# EAGLE design NeoDigito Mini X (EAGLE 9.1.3)
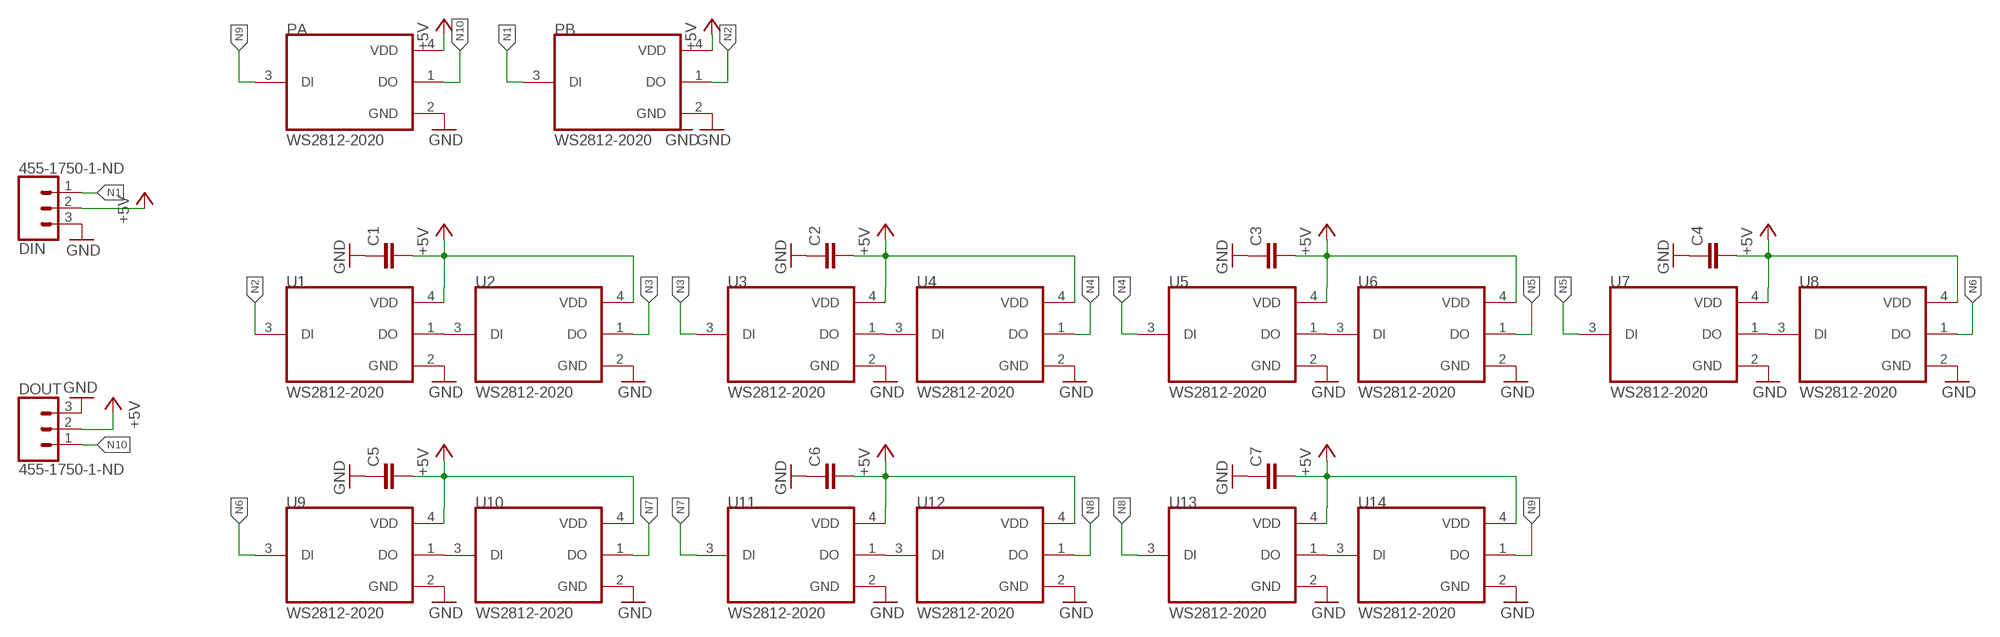
[diagram p0: schematic, sheet 1]

## Parts
C1  C-EUC0805  [C0805]
C2  C-EUC0805  [C0805]
C3  C-EUC0805  [C0805]
C4  C-EUC0805  [C0805]
C5  C-EUC0805  [C0805]
C6  C-EUC0805  [C0805]
C7  C-EUC0805  [C0805]
DIN  455-1750-1-ND  CONN_03  [1X03]
DOUT  455-1750-1-ND  CONN_03  [1X03]
PA  WS2812-2020  [LED_WS2812-2020]
PB  WS2812-2020  [LED_WS2812-2020]
U1  WS2812-2020  [LED_WS2812-2020]
U2  WS2812-2020  [LED_WS2812-2020]
U3  WS2812-2020  [LED_WS2812-2020]
U4  WS2812-2020  [LED_WS2812-2020]
U5  WS2812-2020  [LED_WS2812-2020]
U6  WS2812-2020  [LED_WS2812-2020]
U7  WS2812-2020  [LED_WS2812-2020]
U8  WS2812-2020  [LED_WS2812-2020]
U9  WS2812-2020  [LED_WS2812-2020]
U10  WS2812-2020  [LED_WS2812-2020]
U11  WS2812-2020  [LED_WS2812-2020]
U12  WS2812-2020  [LED_WS2812-2020]
U13  WS2812-2020  [LED_WS2812-2020]
U14  WS2812-2020  [LED_WS2812-2020]

## Nets
+5V: C1.2 C2.2 C3.2 C4.2 C5.2 C6.2 C7.2 DIN.2 DOUT.2 PA.4(VDD) PB.4(VDD) U1.4(VDD) U2.4(VDD) U3.4(VDD) U4.4(VDD) U5.4(VDD) U6.4(VDD) U7.4(VDD) U8.4(VDD) U9.4(VDD) U10.4(VDD) U11.4(VDD) U12.4(VDD) U13.4(VDD) U14.4(VDD)
GND: C1.1 C2.1 C3.1 C4.1 C5.1 C6.1 C7.1 DIN.3 DOUT.3 PA.2(GND) PB.2(GND) U1.2(GND) U2.2(GND) U3.2(GND) U4.2(GND) U5.2(GND) U6.2(GND) U7.2(GND) U8.2(GND) U9.2(GND) U10.2(GND) U11.2(GND) U12.2(GND) U13.2(GND) U14.2(GND)
N1: DIN.1 PB.3(DI)
N2: PB.1(DO) U1.3(DI)
N3: U2.1(DO) U3.3(DI)
N4: U4.1(DO) U5.3(DI)
N5: U6.1(DO) U7.3(DI)
N6: U8.1(DO) U9.3(DI)
N7: U10.1(DO) U11.3(DI)
N8: U12.1(DO) U13.3(DI)
N9: PA.3(DI) U14.1(DO)
N10: DOUT.1 PA.1(DO)
N$1: U1.1(DO) U2.3(DI)
N$2: U3.1(DO) U4.3(DI)
N$3: U5.1(DO) U6.3(DI)
N$4: U7.1(DO) U8.3(DI)
N$5: U9.1(DO) U10.3(DI)
N$6: U11.1(DO) U12.3(DI)
N$7: U13.1(DO) U14.3(DI)

## Library data of the parts
C1-C7 = NeoDigito Mini:C-EU: CAPACITOR, European symbol; SPICEPREFIX: C
DIN DOUT = NeoDigito Mini:CONN_03: Multi connection point. Often used as Generic Header-pin footprint for 0.1 inch spaced/style header connections On any of the 0.1 inch spaced packages, you can populate with these: Break Away Headers - Straight <https://www.sparkfun.com/products/116> (PRT-00116) Break Away Male Headers - Right Angle <https://www.sparkfun.com/products/553> (PRT-00553) Female Headers <https://www.sparkfun.com/products/115> (PRT-00115) Break Away Headers - Machine Pin <https://www.sparkfun.com/products/117> (PRT-00117) Break Away Female Headers - Swiss Machine Pin <https://www.sparkfun.com/products/743> (PRT-00743) Stackable Header - 3 Pin (Female, 0.1") <https://www.sparkfun.com/products/13875> (PRT-13875) For SCREWTERMINALS and SPRING TERMINALS visit here: Screw Terimnals on SparkFun.com <https://www.sparkfun.com/search/results?term=Screw+Terminals> (5mm/3.5mm/2.54mm spacing) This device is also useful as a general connection point to wire up your design to another part of your project. Our various solder wires solder well into these plated through hole pads. Hook-Up Wire - Assortment (Stranded, 22 AWG) <https://www.sparkfun.com/products/11375> (PRT-11375) Hook-Up Wire - Assortment (Solid Core, 22 AWG) <https://www.sparkfun.com/products/11367> (PRT-11367) View the entire wire category on our website here <https://www.sparkfun.com/categories/141> Special notes: Molex polarized connector foot print use with SKU : PRT-08232 with associated crimp pins and housings.; PROD_ID: XXX-00000
PA PB U1-U14 = NeoDigito Mini:WS2812-2020: Intelligent control LED integrated light source; AVAILABILITY: Unavailable; MF: Worldsemi; MP: WS2812-2020; PACKAGE: Package; PRICE: None

## Board
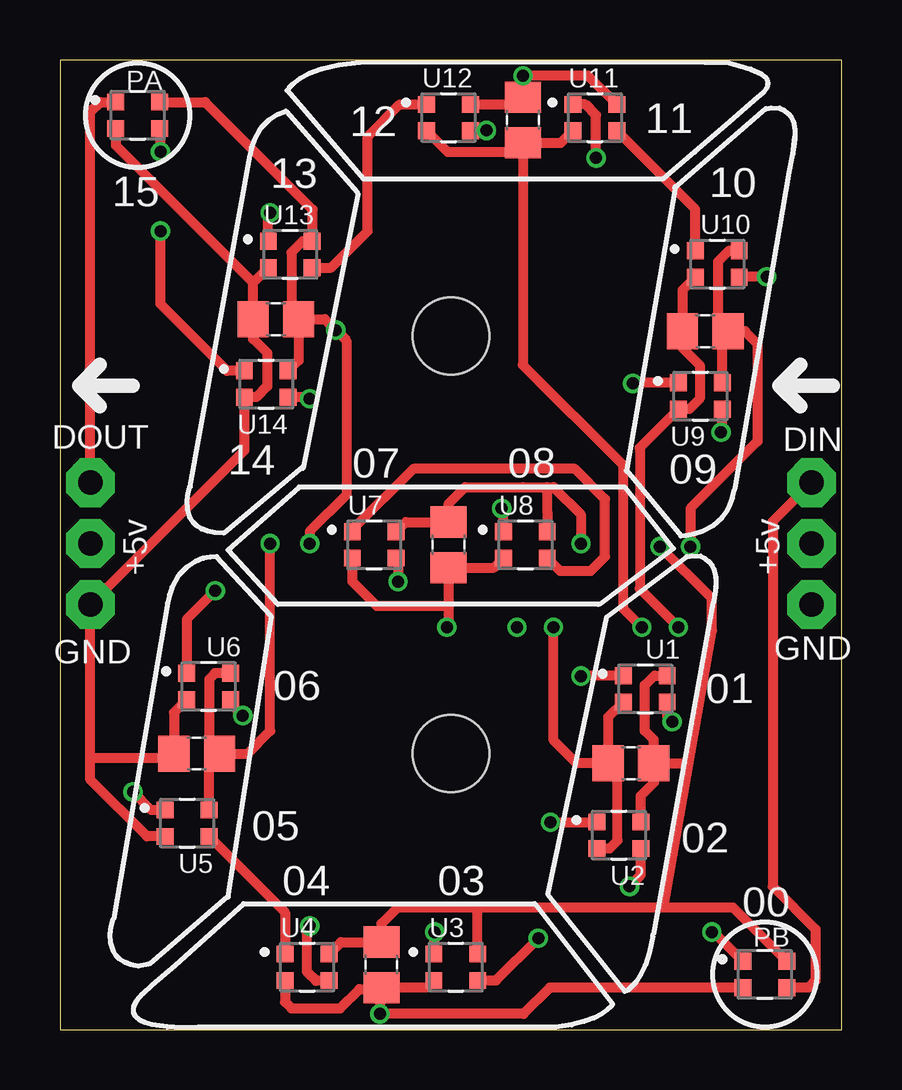
[diagram p1: board, top side]
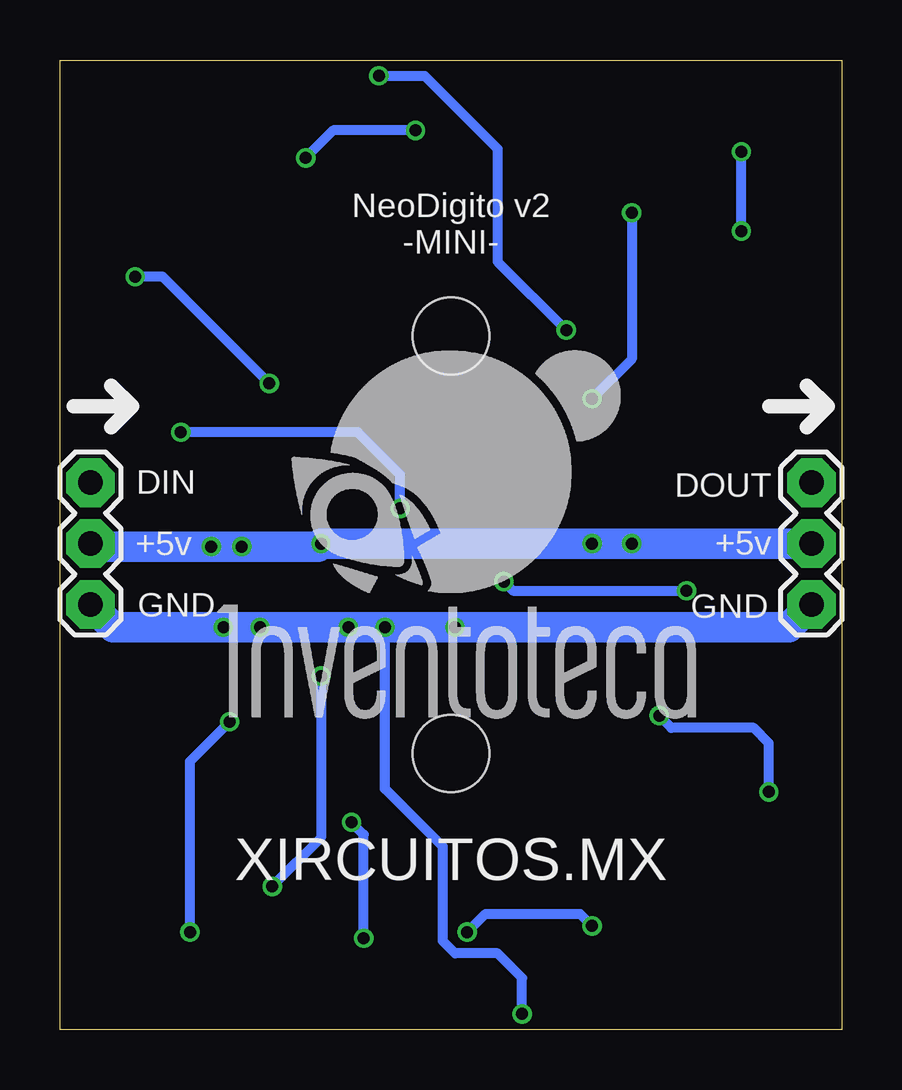
[diagram p2: board, bottom side, seen from below]

Size 32.6 x 40.4 mm. Coordinates in mm from the lower left corner, seen from the top.
Outline: 0,0 32.6,0 32.6,40.4 0,40.4 0,0
Copper layers (1*16): Top 0.035mm / dielectric 1.5mm / Bottom 0.035mm
Design rules "_xircuitos.mx_2L_DRC": minimum track width 6mil, minimum drill 12mil, track to track 6mil, track to pad 6mil, pad to pad 6mil, via to via 6mil, smd to smd 0mil, copper to edge 10mil, drill to drill 12mil, minimum pad ring 10mil, minimum via ring 6mil, stop-mask expansion 2mil, vias tented up to drill 100mil, thermal gap 10mil
Holes 3.2 mm at 16.3,11.5 16.3,28.9

### Footprints (pad centres in the part's own frame; a part is rotated, then mirrored left to right if it is on the bottom)
C0805 = smd 1.3 x 1.5: 1 -0.95,0; 2 0.95,0
1X03 = drill 1.016 pad 2.032 octagon: 1 -2.54,0; 2 0,0; 3 2.54,0
LED_WS2812-2020 = smd 0.7 x 0.7: 1 -0.915,0.55; 2 -0.915,-0.55; 3 0.915,-0.55; 4 0.915,0.55

### Placement (x,y rotation side)
C1  23.8,11.1 0 top
C2  13.4,2.7 90 top
C3  5.7,11.5 0 top
C4  16.2,20.2 90 top
C5  26.9,29.1 0 top
C6  19.3,37.9 90 top
C7  9,29.6 0 top
DIN  31.33,20.25 270 bottom
DOUT  1.27,20.25 270 bottom
PA  3.24,38.1 0 top
PB  29.38,2.3 0 top
U1  24.4,14.2 0 top
U2  23.3,8.1 0 top
U3  16.5,2.6 0 top
U4  10.3,2.6 0 top
U5  5.3,8.6 0 top
U6  6.2,14.3 0 top
U7  13.1,20.2 0 top
U8  19.4,20.2 0 top
U9  26.7,26.4 0 top
U10  27.4,31.9 0 top
U11  22.3,38 0 top
U12  16.2,38 0 top
U13  9.6,32.3 0 top
U14  8.6,26.9 0 top

### Tracks (layer width: path | path; a pad name or v marks a point on that pad's centre or on a via)
+5V  (via drill 0.5)
  Top 0.406: 25.15,5.08 26.19,11.04 | 26.19,11.04 27.18,16.64 27.18,17.96 v25.02,20.12 | 24.77,11.1 C1.2 24.75,12.08 24.38,12.45 24.38,14.35 24.78,14.75 U1.4 | 24.77,11.1 26.14,11.1 26.19,11.04 | U2.4 24.21,9.74 24.77,10.29 24.77,11.1 | PB.4 28.07,5.08 25.15,5.08 | U6.4 6.47,14.85 6.22,14.61 6.22,11.93 C3.2 | U5.4 6.21,11.06 C3.2 | C7.2 9.95,27.89 U14.4 | C7.2 9.65,29.9 9.65,32.38 10.12,32.85 U13.4 10.52,34.14 10.54,34.16 6.05,38.65 PA.4 | U12.4 19,38.55 C6.2 v19.3,39.74 | U11.4 22.01,39.75 v19.31,39.75 v19.3,39.74 | U10.4 27.88,32.45 27.43,32 27.43,29.52 C5.2 | U9.4 27.61,28.86 C5.2 | C5.2 28.56,29.1 29.08,28.57 29.08,24.51 26.29,21.72 v26.29,20.12 | 25.15,5.08 17.4,5.08 | 17.4,5.08 14.07,5.08 13.4,4.41 C2.2 11.71,3.65 U4.4 | U3.4 17.4,3.17 17.4,5.08 | C3.2 7.82,11.5 8.76,12.45 v8.76,20.25 | U7.4 14.41,21.15 C4.2 16.2,21.91 16.89,22.61 19.3,22.61 20.32,22.61 | U8.4 20.32,21.59 20.32,22.1 20.32,22.61 | 20.32,22.61 20.57,22.61 21.72,21.46 v21.72,20.25 | C7.2 11.04,29.6 v11.49,29.15 11.94,28.7 11.94,22.28 10.41,20.76 v10.41,20.25 | v19.3,39.74
  Bottom 0.406: v11.49,29.15 14.35,32 14.35,36.7 17.4,39.74 v19.3,39.74
  Bottom 1.27: DOUT.2 v8.76,20.25 v10.41,20.25 v21.72,20.25 21.84,20.12 v25.02,20.12 v26.29,20.12 31.2,20.12 DIN.2
GND  (via drill 0.5)
  Top 0.406: U10.2 25.95,30.82 C5.1 25.95,28.41 26.67,27.69 26.67,26.29 26.23,25.85 U9.2 24.18,24.24 24.18,18.37 v25.78,16.76 | C6.1 20.89,36.95 U11.2 | U12.2 16.16,36.58 18.93,36.58 C6.1 | 8.05,31.11 C7.1 8.05,28.78 8.64,28.19 8.64,26.8 8.19,26.35 U14.2 7.68,24.12 DOUT.3 1.27,11.3 | 8.05,31.11 U13.2 | PA.2 2.33,36.84 8.05,31.11 | U3.2 15.29,1.75 C2.1 13.34,1.69 | U6.2 4.75,13.21 C3.1 4.55,11.3 3.3,11.3 1.27,11.3 | U5.2 3.63,8.05 1.27,10.41 1.27,11.3 | U8.2 18.09,19.25 C4.1 16.2,18.03 16.2,17.65 | U7.2 12.19,18.68 13.21,17.65 16.2,17.65 | v16.13,16.76 16.2,16.84 16.2,17.65 | C6.1 19.3,27.69 23.46,23.53 23.46,17.56 v24.26,16.76 | PB.2 20.42,1.75 19.32,0.66 v13.34,0.66 13.34,1.69 | C1.1 21.54,11.1 20.57,12.06 v20.57,16.76 | U1.2 22.85,13.02 C1.1 | U2.2 22.92,7.55 23.24,7.87 23.24,10.71 C1.1 | U4.2 9.38,1.16 9.65,0.89 11.68,0.89 12.48,1.69 13.34,1.69
  Bottom 0.406: v13.34,0.66 13.34,2.16 14.35,3.17 16.13,3.17 16.64,3.68 16.64,7.62 19.05,10.03 v19.05,16.76
  Bottom 1.27: DOUT.3 2.22,16.76 v16.13,16.76 v19.05,16.76 v20.57,16.76 v24.26,16.76 v25.78,16.76 30.38,16.76 DIN.3
N1
  Top 0.406: DIN.1 29.72,21.18 29.72,5.97 31.5,4.19 31.5,2.03 31.21,1.75 PB.3
N2  (via drill 0.5)
  Top 0.406: PB.1 27.25,4.06 v27.18,4.06 | v25.53,12.83 25.32,13.04 U1.3
  Bottom 0.406: v27.18,4.06 27.18,11.18 v25.53,12.83
N3  (via drill 0.5)
  Top 0.406: U3.3 18.18,2.05 v19.94,3.81 | v20.45,8.64 v20.46,8.65 U2.1
  Bottom 0.406: v19.94,3.81 19.94,8.13 v20.45,8.64
N4
  Top 0.406: U5.3 9.38,4.88 U4.1
N5  (via drill 0.5)
  Top 0.406: U7.3 14.1,19.57 v14.1,18.67 | v6.48,18.29 5.29,17.1 U6.1
  Bottom 0.406: v14.1,18.67 13.72,18.29 v6.48,18.29
N6  (via drill 0.5)
  Top 0.406: U8.1 18.48,21.65 v18.41,21.72 | v27.56,24.89 27.61,24.95 U9.3
  Bottom 0.406: v18.41,21.72 18.41,23.11 20.19,24.89 v27.56,24.89
N7
  Top 0.406: U10.1 26.48,34.18 U11.3
N8
  Top 0.406: U13.3 11.3,31.75 12.83,33.27 12.83,37.21 14.17,38.55 U12.1
N9  (via drill 0.5)
  Top 0.406: U14.1 6.97,27.45 4.19,30.23 v4.19,33.27 | v4.19,36.58 4.19,37.52 PA.3
  Bottom 0.406: v4.19,33.27 v4.19,36.58
N10
  Top 0.406: DOUT.1 1.27,38.23 1.69,38.65 PA.1
N$1  (via drill 0.5)
  Top 0.406: U1.1 21.73,14.75 v21.72,14.73 | v23.75,5.97 24.21,6.43 U2.3
  Bottom 0.406: v21.72,14.73 21.72,8 v23.75,5.97
N$2  (via drill 0.5)
  Top 0.406: U3.1 15.62,3.19 v15.62,4.06 | v10.41,4.32 10.29,4.19 10.29,2.41 10.67,2.03 10.69,2.05 U4.3
  Bottom 0.406: v15.62,4.06 14.86,4.83 10.92,4.83 v10.41,4.32
N$3  (via drill 0.5)
  Top 0.406: U5.1 3.8,9.15 v3.05,9.91 | v7.62,13.08 7.12,13.59 U6.3
  Bottom 0.406: v3.05,9.91 3.05,11.94 3.68,12.57 7.11,12.57 v7.62,13.08
N$4
  Top 0.406: U8.3 20.85,19.11 22.14,19.11 22.73,19.7 22.73,22.11 21.46,23.37 14.73,23.37 12.19,20.82 U7.1
N$5  (via drill 0.5)
  Top 0.406: U9.1 23.9,26.95 v23.88,26.92 | v29.46,31.37 28.33,31.37 U10.3
  Bottom 0.406: v23.88,26.92 28.32,31.37 v29.46,31.37
N$6  (via drill 0.5)
  Top 0.406: U12.3 17.77,37.45 v17.78,37.47 | v22.35,36.32 22.35,38.1 21.9,38.55 U11.1
  Bottom 0.406: v17.78,37.47 21.21,37.47 v22.35,36.32
N$7  (via drill 0.5)
  Top 0.406: U13.1 8.69,33.96 v8.76,34.04 | v10.41,26.29 10.35,26.35 U14.3
  Bottom 0.406: v8.76,34.04 8.76,27.94 v10.41,26.29

### Text on the board
tPlace: 12 | 11 | 13 | 10 | 15 | DOUT | DIN | 14 | 07 | 08 | 09 | +5v | +5v | GND | GND | 06 | 01 | 05 | 02 | 04 | 03 | 00
bPlace: NeoDigito v2 / -MINI- | +5v | +5v | GND | GND | XIRCUITOS.MX